# EAGLE schematic schemat-eagle (EAGLE 6.5.0)
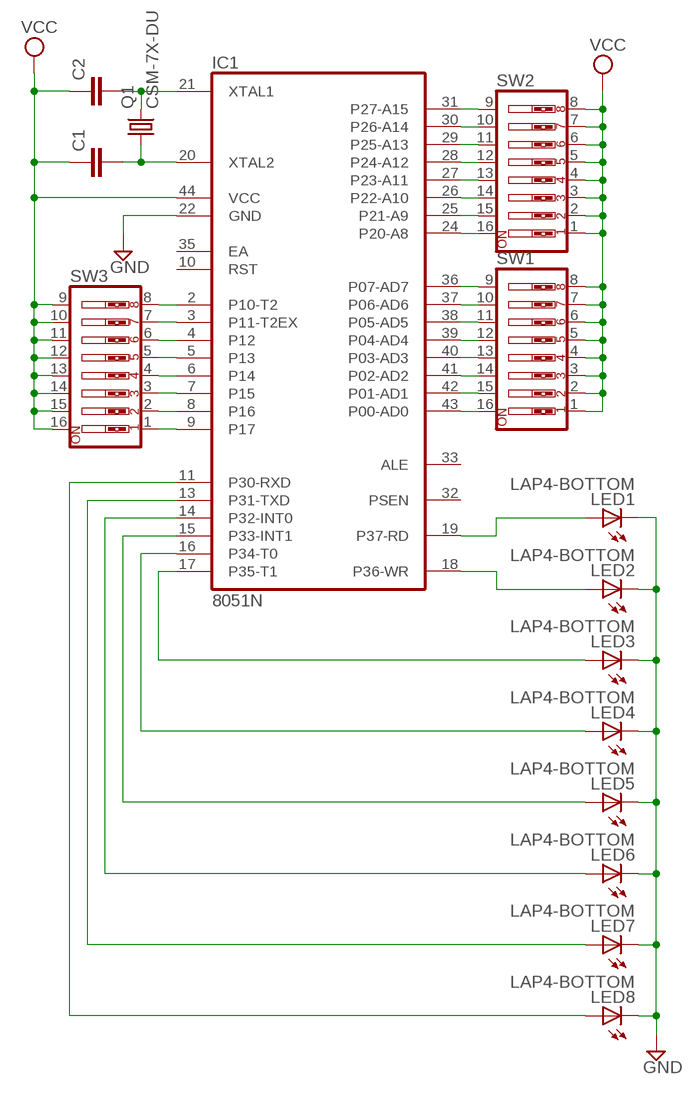
[diagram p0: schematic, sheet 1]

## Parts
C1  C22/6  [C22.5B6]
C2  C22/6  [C22.5B6]
IC1  8051N  [PLCC44]
LED1  LAP4-BOTTOM  [P47F-BOTTOM]
LED2  LAP4-BOTTOM  [P47F-BOTTOM]
LED3  LAP4-BOTTOM  [P47F-BOTTOM]
LED4  LAP4-BOTTOM  [P47F-BOTTOM]
LED5  LAP4-BOTTOM  [P47F-BOTTOM]
LED6  LAP4-BOTTOM  [P47F-BOTTOM]
LED7  LAP4-BOTTOM  [P47F-BOTTOM]
LED8  LAP4-BOTTOM  [P47F-BOTTOM]
Q1  CSM-7X-DU  [CSM-7X-DU]
SW1  SW_DIP-8  [EDG-08]
SW2  SW_DIP-8  [EDG-08]
SW3  SW_DIP-8  [EDG-08]

## Nets
GND: IC1.22(GND) LED1.C LED2.C LED3.C LED4.C LED5.C LED6.C LED7.C LED8.C
N$1: IC1.2(P10-T2) SW3.8
N$2: IC1.3(P11-T2EX) SW3.7
N$3: IC1.4(P12) SW3.6
N$4: IC1.5(P13) SW3.5
N$5: IC1.6(P14) SW3.4
N$6: IC1.7(P15) SW3.3
N$7: IC1.8(P16) SW3.2
N$8: IC1.9(P17) SW3.1
N$9: IC1.43(P00-AD0) SW1.16
N$10: IC1.42(P01-AD1) SW1.15
N$11: IC1.41(P02-AD2) SW1.14
N$12: IC1.40(P03-AD3) SW1.13
N$13: IC1.39(P04-AD4) SW1.12
N$14: IC1.38(P05-AD5) SW1.11
N$15: IC1.37(P06-AD6) SW1.10
N$16: IC1.36(P07-AD7) SW1.9
N$17: IC1.24(P20-A8) SW2.16
N$18: IC1.25(P21-A9) SW2.15
N$19: IC1.26(P22-A10) SW2.14
N$20: IC1.27(P23-A11) SW2.13
N$21: IC1.28(P24-A12) SW2.12
N$22: IC1.29(P25-A13) SW2.11
N$23: IC1.30(P26-A14) SW2.10
N$24: IC1.31(P27-A15) SW2.9
N$27: IC1.19(P37-RD) LED1.A
N$28: IC1.18(P36-WR) LED2.A
N$29: IC1.17(P35-T1) LED3.A
N$30: IC1.16(P34-T0) LED4.A
N$31: IC1.15(P33-INT1) LED5.A
N$32: IC1.14(P32-INT0) LED6.A
N$33: IC1.13(P31-TXD) LED7.A
N$34: IC1.11(P30-RXD) LED8.A
N$36: C1.2 IC1.20(XTAL2) Q1.1
N$37: C2.2 IC1.21(XTAL1) Q1.2
VCC: C1.1 C2.1 IC1.44(VCC) SW1.1 SW1.2 SW1.3 SW1.4 SW1.5 SW1.6 SW1.7 SW1.8 SW2.1 SW2.2 SW2.3 SW2.4 SW2.5 SW2.6 SW2.7 SW2.8 SW3.9 SW3.10 SW3.11 SW3.12 SW3.13 SW3.14 SW3.15 SW3.16
Unconnected: IC1.10(RST) IC1.32(PSEN) IC1.33(ALE) IC1.35(EA)

## Library data of the parts
C1 C2 = capacitor-wima:C: CAPACITOR naming: grid - package width
IC1 = micro-intel:8051: (CHMOS) SINGLE-CHIP 8-BIT MICROCONTROLLER 80C31BH / 80C51 BH / 87C51 MCS 51 Source: http://apps.intel.com .. 27041907.pdf; OC_FARNELL: unknown; OC_NEWARK: unknown
LED1-LED8 = led:*P4: PointLED® Enhanced Thinfilm LED TOP & BOTTOM mount LS P47F, LR P47F, LA P47F, LY P47F, LT P4SG, LB P4SG, LW P4SG Source: http://catalog.osram-os.com .. LA_LR_LS_LY_P47F_Pb_free.pdf
Q1 = crystal:CSM-7X-DU: SMD CRYSTAL Source: www.ecsxtal.com .. Crystal 3.6864MHz CSM_7X_DU.PDF; OC_FARNELL: unknown; OC_NEWARK: unknown
SW1-SW3 = special:SW_DIP-8: DIP SWITCH